# EAGLE schematic DorothiController (EAGLE 9.2.2)

## Sheet 1 of 3
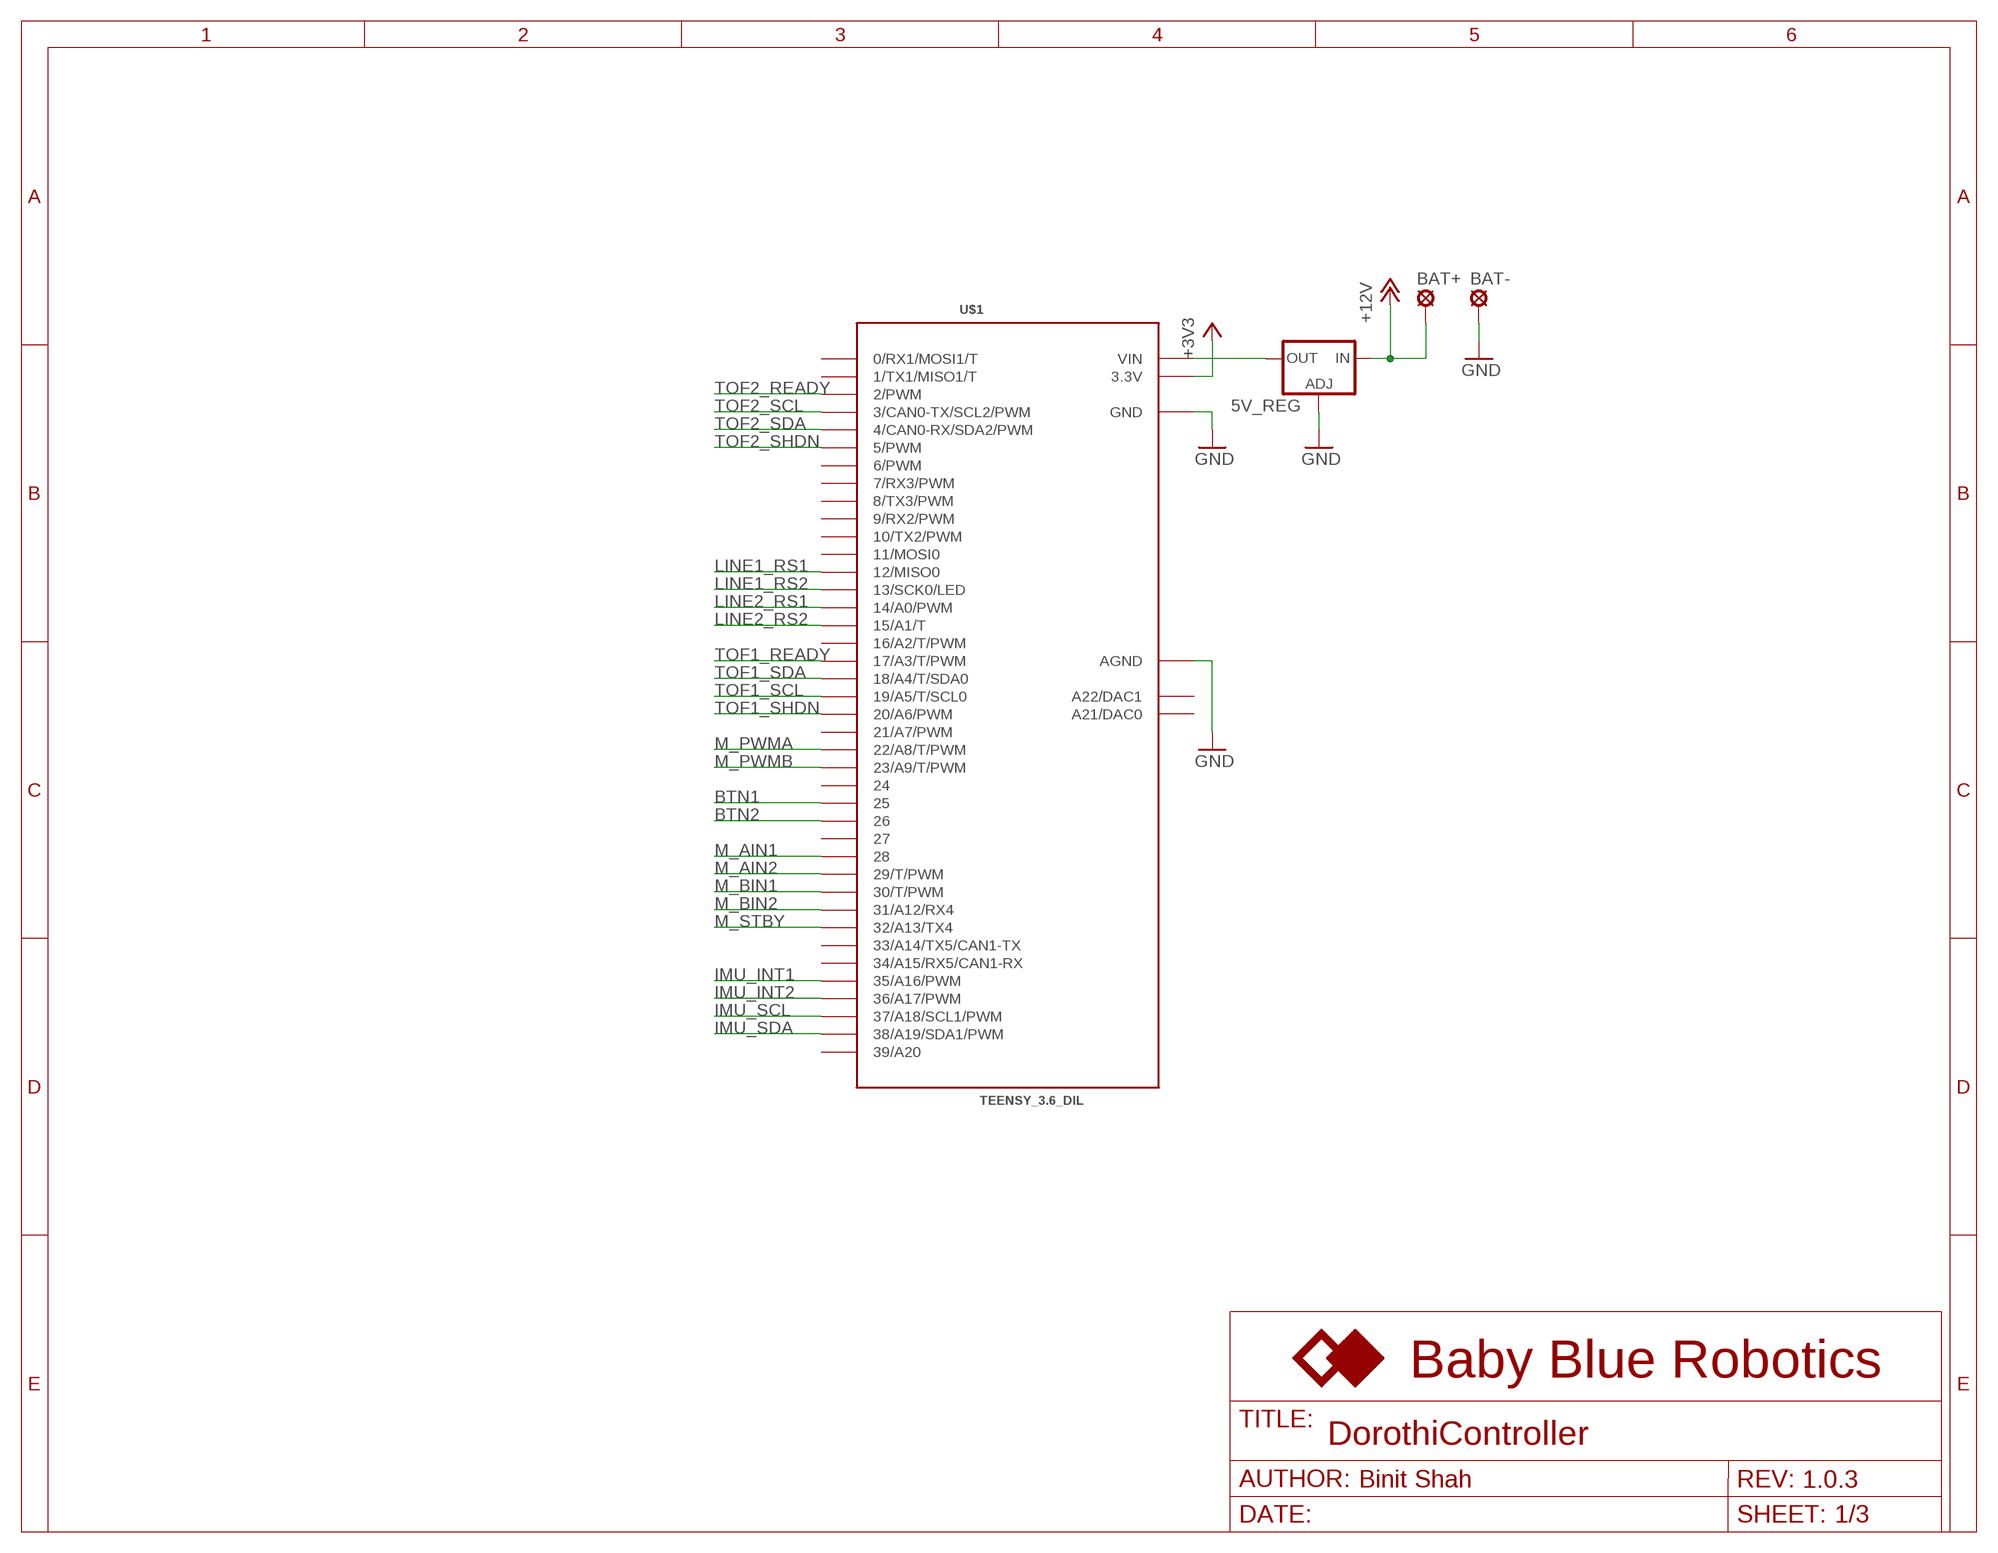
[diagram p0: schematic, sheet 1]
FRAME1 (FRAME_A_L): AUTHOR_NAME: Binit Shah; REV: 1.0.3

### Parts
5V_REG  LM138-TL  [TO220L1]
BAT+  24_SOLPAD  [WIRE_SOLPAD]
BAT-  24_SOLPAD  [WIRE_SOLPAD]
U$1  TEENSY_3.6_DIL  [TEENSY_3.6_DIL]

### Nets
+3V3: U$1.3.3V U$1.3.3V3(3.3V) ; also sheet 2,3
+12V: 5V_REG.3(IN) BAT+.P$1(MP) ; also sheet 2
BTN1: U$1.25 ; also sheet 3
BTN2: U$1.26 ; also sheet 3
GND: 5V_REG.1(ADJ) BAT-.P$1(MP) U$1.AGND U$1.GND U$1.GND1(GND) ; also sheet 2,3
IMU_INT1: U$1.35/A16(35/A16/PWM) ; also sheet 3
IMU_INT2: U$1.36/A17(36/A17/PWM) ; also sheet 3
IMU_SCL: U$1.37/A18(37/A18/SCL1/PWM) ; also sheet 3
IMU_SDA: U$1.38/A19(38/A19/SDA1/PWM) ; also sheet 3
LINE1_RS1: U$1.12(12/MISO0) ; also sheet 3
LINE1_RS2: U$1.13(13/SCK0/LED) ; also sheet 3
LINE2_RS1: U$1.14/A0(14/A0/PWM) ; also sheet 3
LINE2_RS2: U$1.15/A1(15/A1/T) ; also sheet 3
M_AIN1: U$1.28 ; also sheet 2
M_AIN2: U$1.29(29/T/PWM) ; also sheet 2
M_BIN1: U$1.30(30/T/PWM) ; also sheet 2
M_BIN2: U$1.31/A12(31/A12/RX4) ; also sheet 2
M_PWMA: U$1.22/A8(22/A8/T/PWM) ; also sheet 2
M_PWMB: U$1.23/A9(23/A9/T/PWM) ; also sheet 2
M_STBY: U$1.32/A13(32/A13/TX4) ; also sheet 2
N$6: 5V_REG.2(OUT) U$1.VIN
TOF1_READY: U$1.17/A3(17/A3/T/PWM) ; also sheet 3
TOF1_SCL: U$1.19/A5(19/A5/T/SCL0) ; also sheet 3
TOF1_SDA: U$1.18/A4(18/A4/T/SDA0) ; also sheet 3
TOF1_SHDN: U$1.20/A6(20/A6/PWM) ; also sheet 3
TOF2_READY: U$1.2(2/PWM) ; also sheet 3
TOF2_SCL: U$1.3(3/CAN0-TX/SCL2/PWM) ; also sheet 3
TOF2_SDA: U$1.4(4/CAN0-RX/SDA2/PWM) ; also sheet 3
TOF2_SHDN: U$1.5(5/PWM) ; also sheet 3
Unconnected: U$1.0(0/RX1/MOSI1/T) U$1.1(1/TX1/MISO1/T) U$1.6(6/PWM) U$1.7(7/RX3/PWM) U$1.8(8/TX3/PWM) U$1.9(9/RX2/PWM) U$1.10(10/TX2/PWM) U$1.11(11/MOSI0) U$1.16/A2(16/A2/T/PWM) U$1.21/A7(21/A7/PWM) U$1.24 U$1.27 U$1.33/A14(33/A14/TX5/CAN1-TX) U$1.34/A15(34/A15/RX5/CAN1-RX) U$1.39/A20 U$1.A21(A21/DAC0) U$1.A22(A22/DAC1)

## Sheet 2 of 3
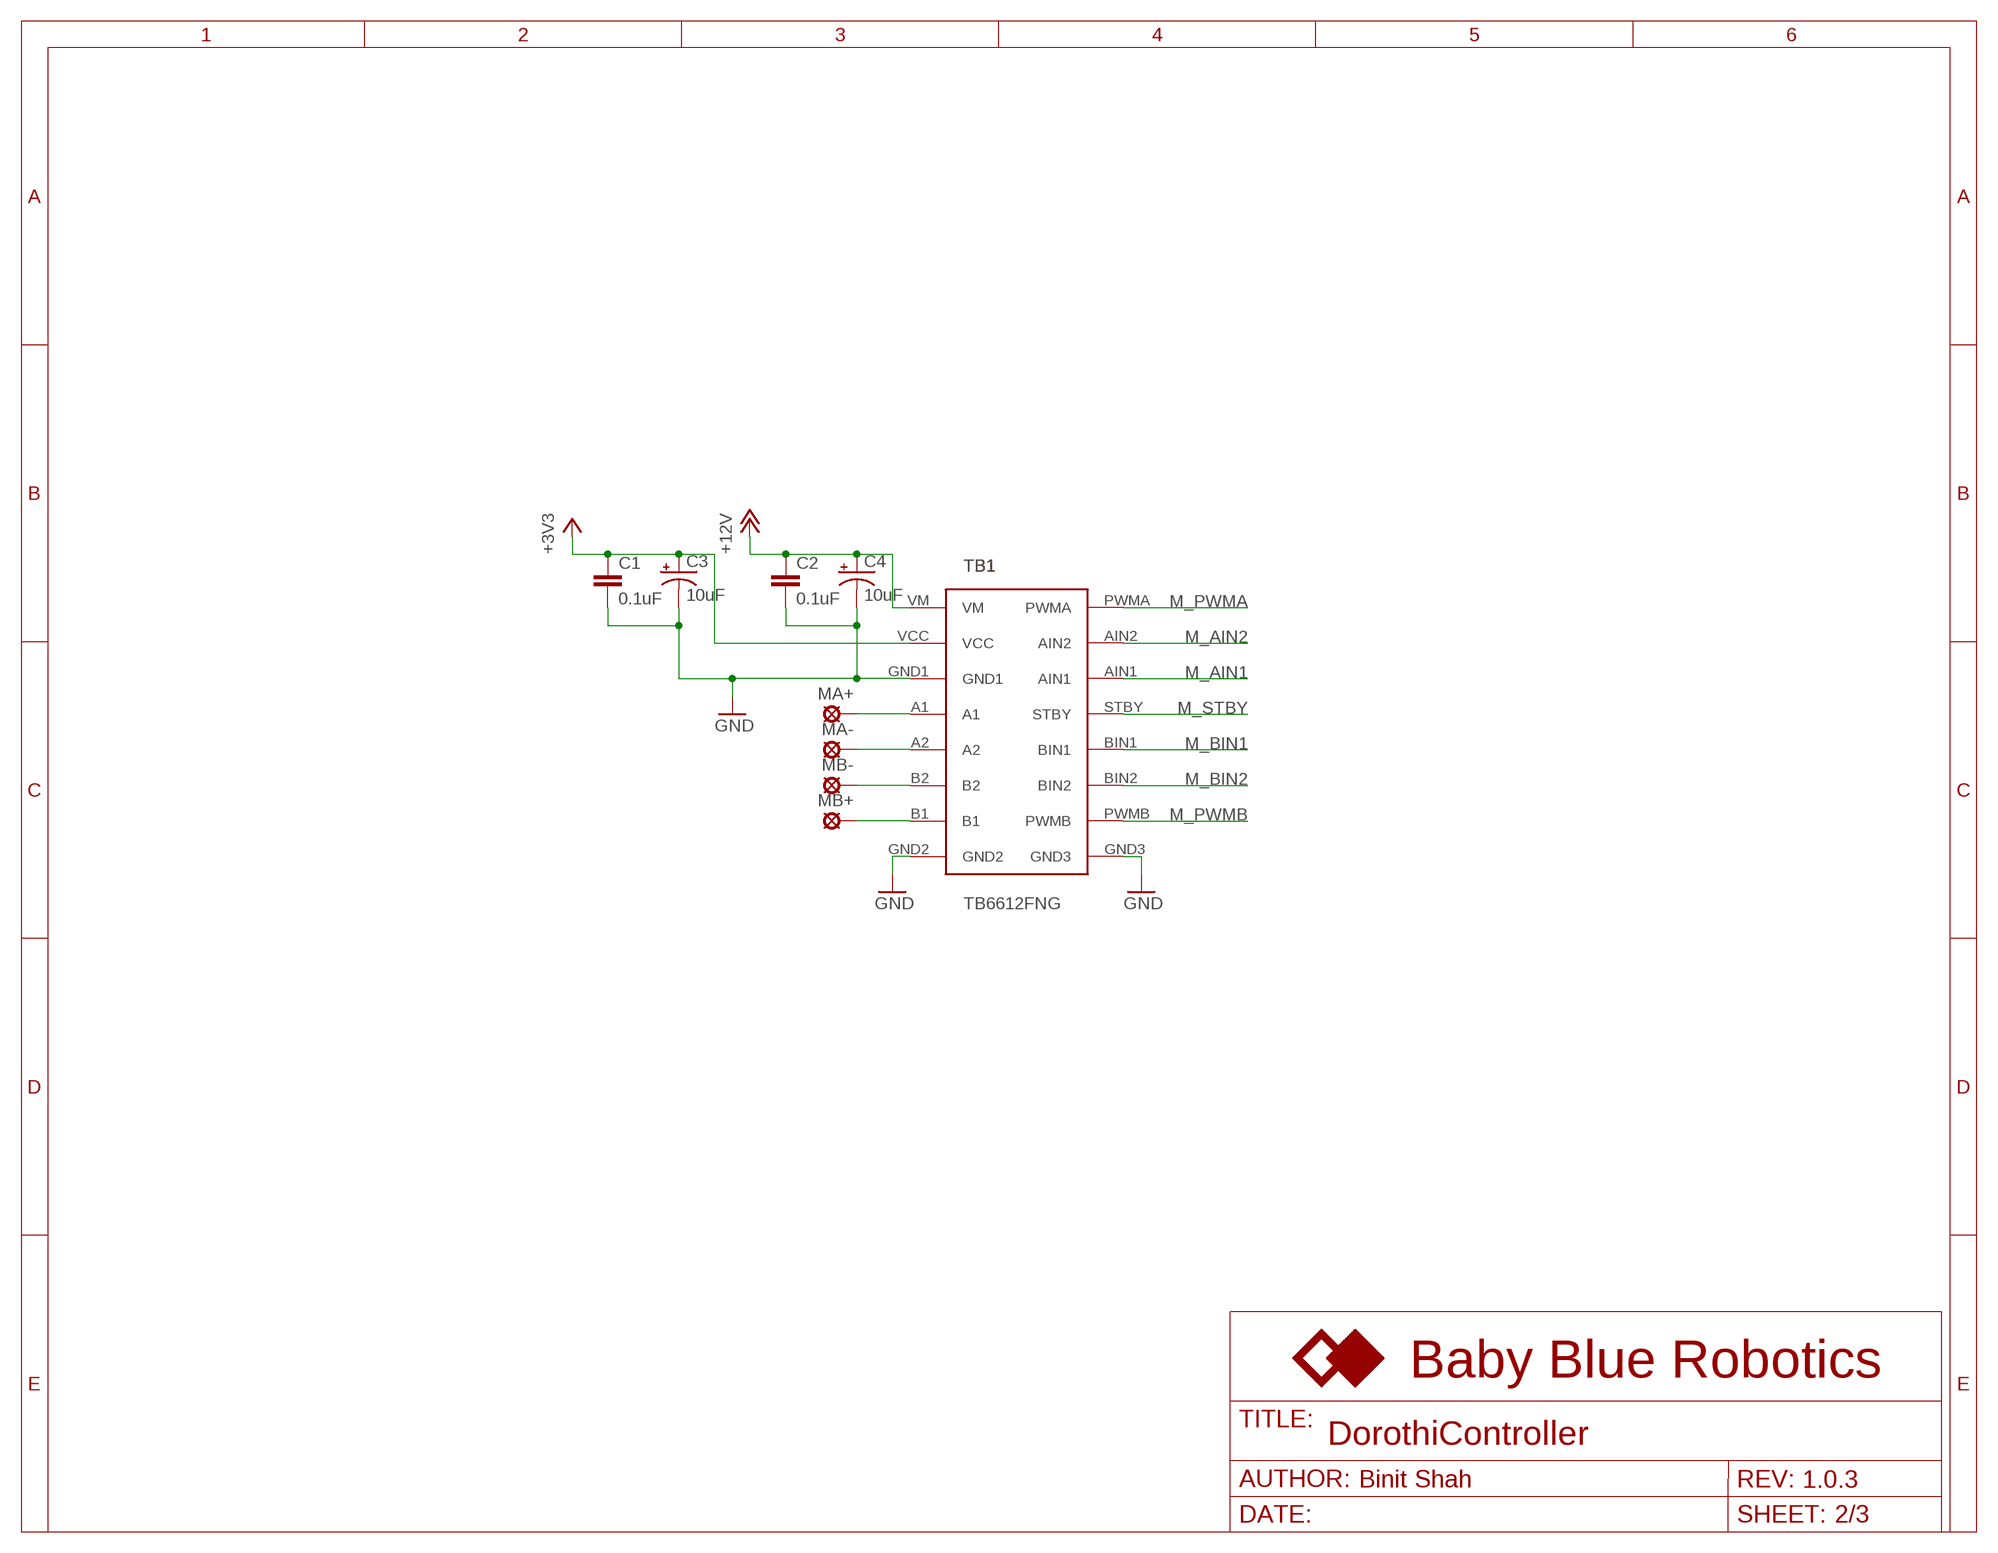
[diagram p1: schematic, sheet 2]
FRAME2 (FRAME_A_L): AUTHOR_NAME: Binit Shah; REV: 1.0.3

### Parts
C1  0.1uF  0.1UF-0603-25V-5%  [0603]
C2  0.1uF  0.1UF-0603-25V-5%  [0603]
C3  10uF  10UF-POLAR-EIA3528-20V-10%(TANT)  [EIA3528]
C4  10uF  10UF-POLAR-EIA3528-20V-10%(TANT)  [EIA3528]
MA+  24_SOLPAD  [WIRE_SOLPAD]
MA-  24_SOLPAD  [WIRE_SOLPAD]
MB+  24_SOLPAD  [WIRE_SOLPAD]
MB-  24_SOLPAD  [WIRE_SOLPAD]
TB1  TB6612FNG  [TB6612FNG]

### Nets
+3V3: C1.1 C3.A(+) TB1.VCC ; also sheet 1,3
+12V: C2.1 C4.A(+) TB1.VM ; also sheet 1
GND: C1.2 C2.2 C3.C(-) C4.C(-) TB1.GND1 TB1.GND2 TB1.GND3 ; also sheet 1,3
M_AIN1: TB1.AIN1 ; also sheet 1
M_AIN2: TB1.AIN2 ; also sheet 1
M_BIN1: TB1.BIN1 ; also sheet 1
M_BIN2: TB1.BIN2 ; also sheet 1
M_PWMA: TB1.PWMA ; also sheet 1
M_PWMB: TB1.PWMB ; also sheet 1
M_STBY: TB1.STBY ; also sheet 1
MA+: MA+.P$1(MP) TB1.A1
MA-: MA-.P$1(MP) TB1.A2
MB+: MB+.P$1(MP) TB1.B1
MB-: MB-.P$1(MP) TB1.B2

## Sheet 3 of 3
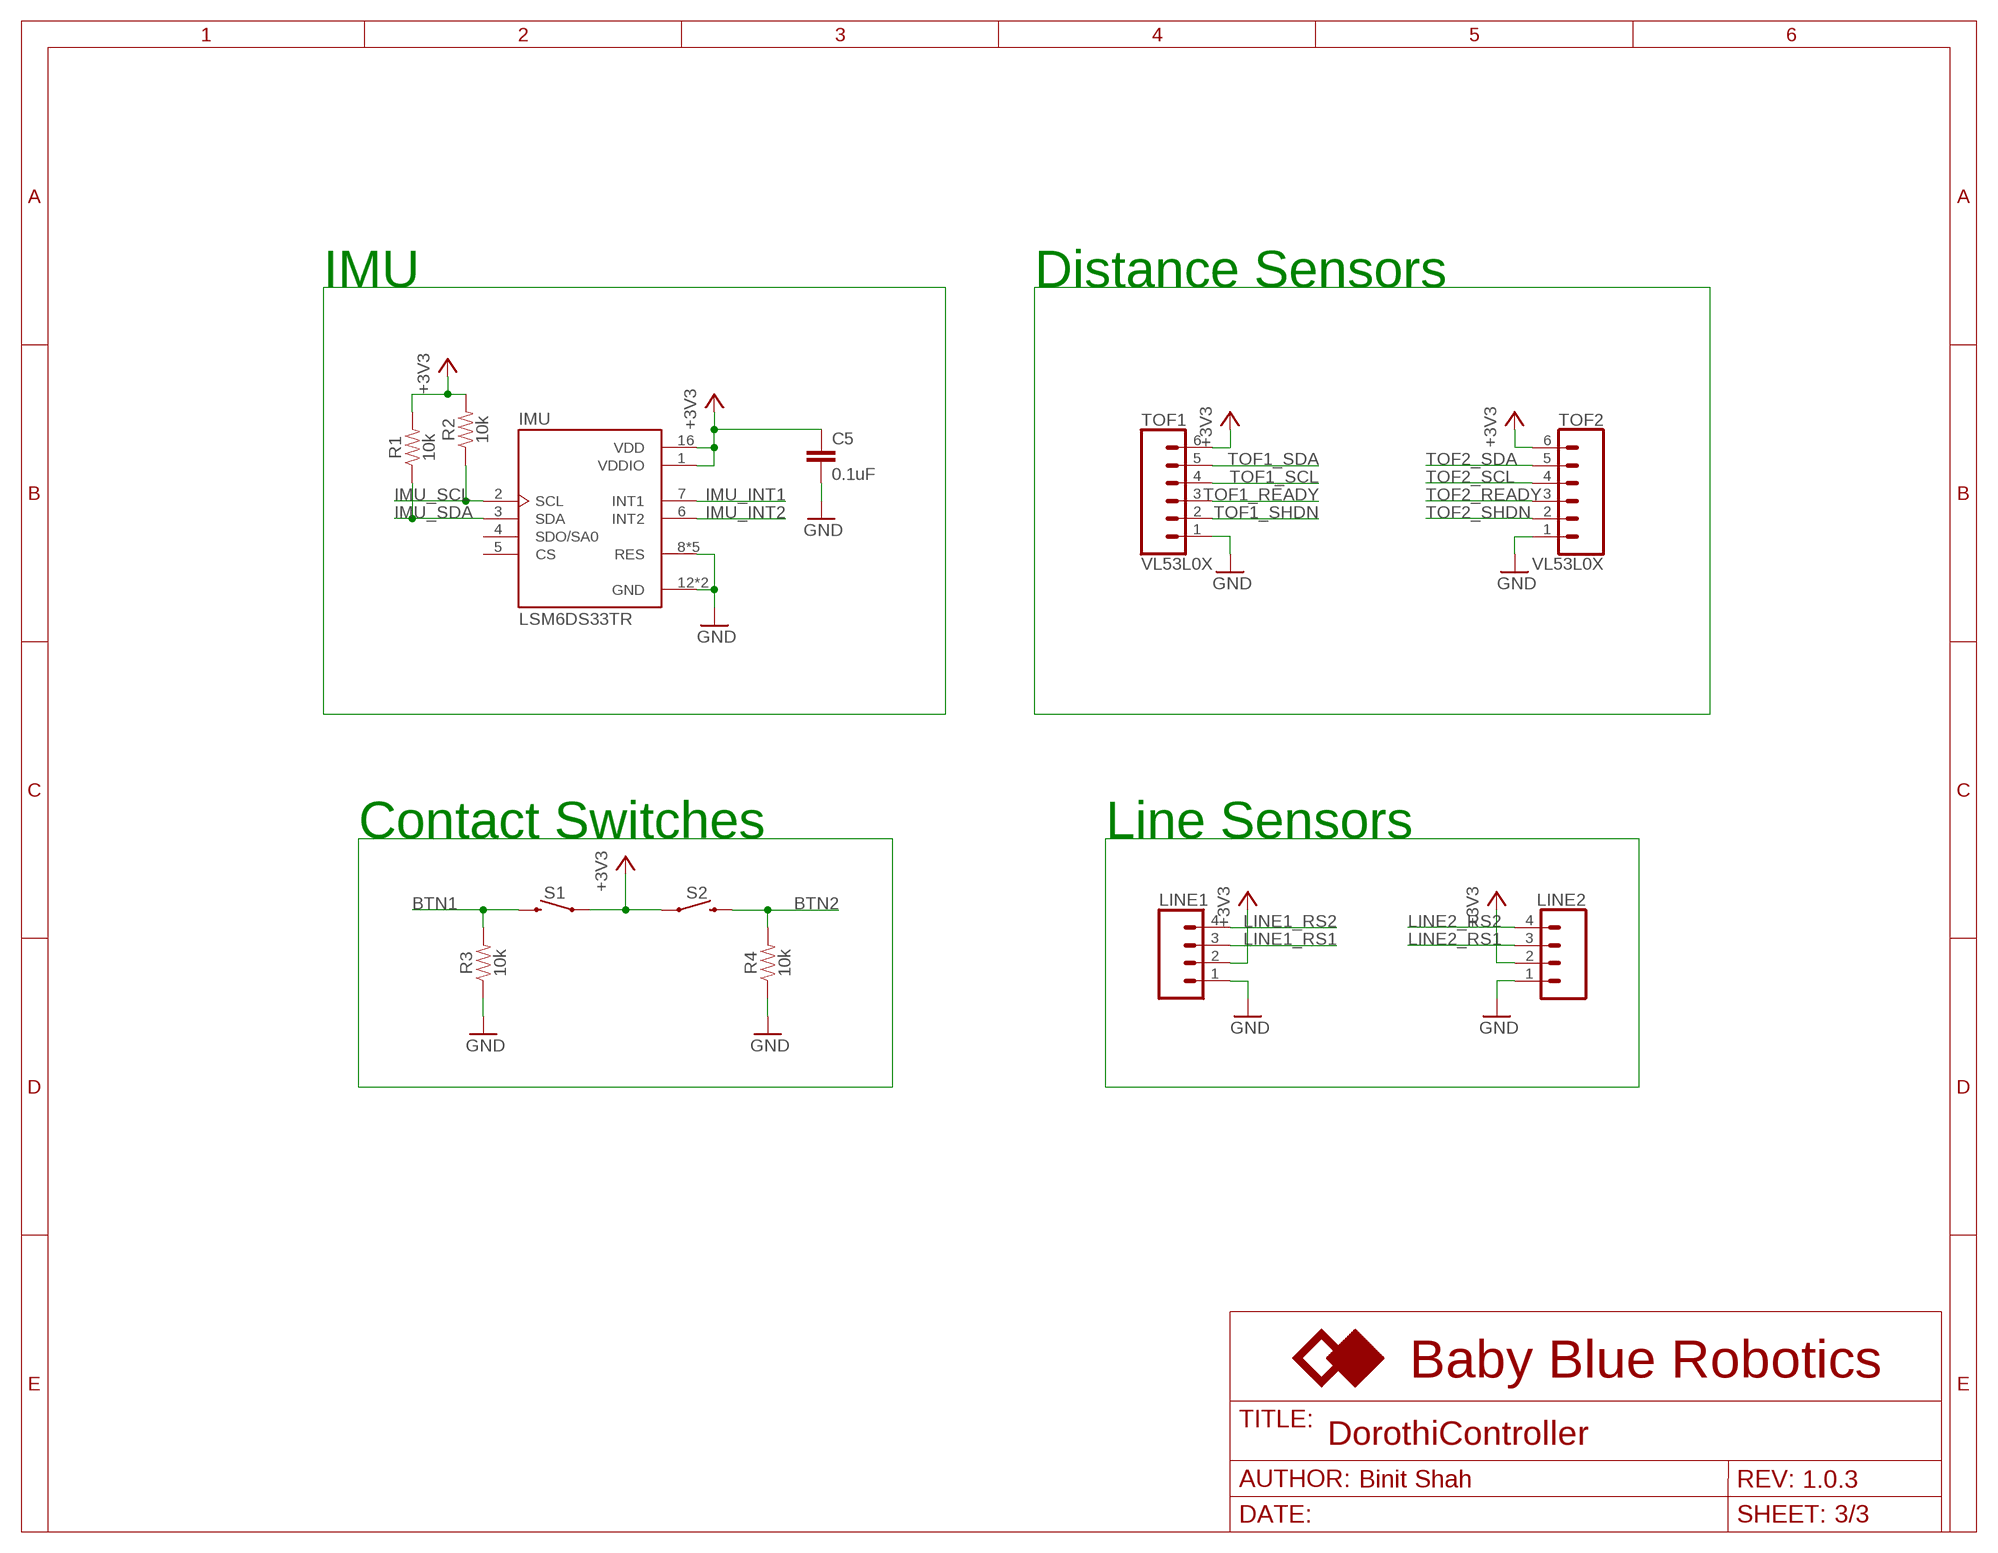
[diagram p2: schematic, sheet 3]
FRAME3 (FRAME_A_L): AUTHOR_NAME: Binit Shah; REV: 1.0.3

### Parts
C5  0.1uF  0.1UF-0603-25V-5%  [0603]
IMU  LSM6DS33TR  [PQFN50P300X300X86-16N]
LINE1  CONN_04  [1X04]
LINE2  CONN_04  [1X04]
R1  10k  10KOHM-0603-1/10W-1%  [0603]
R2  10k  10KOHM-0603-1/10W-1%  [0603]
R3  10k  10KOHM-0603-1/10W-1%  [0603]
R4  10k  10KOHM-0603-1/10W-1%  [0603]
S1  MOMENTARY-SWITCH-SPST-PTH-12MM  [TACTILE_SWITCH_PTH_12MM]
S2  MOMENTARY-SWITCH-SPST-PTH-12MM  [TACTILE_SWITCH_PTH_12MM]
TOF1  VL53L0X  CONN_06SILK_FEMALE_PTH  [1X06]
TOF2  VL53L0X  CONN_06SILK_FEMALE_PTH  [1X06]

### Nets
+3V3: C5.1 IMU.1(VDDIO) IMU.16(VDD) LINE1.2 LINE2.2 R1.2 R2.2 S1.1 S2.1 TOF1.6 TOF2.6 ; also sheet 1,2
BTN1: R3.2 S1.3 ; also sheet 1
BTN2: R4.2 S2.3 ; also sheet 1
GND: C5.2 IMU.8(RES) IMU.9(RES) IMU.10(RES) IMU.11(RES) IMU.12(GND) IMU.13(GND) IMU.15(RES) LINE1.1 LINE2.1 R3.1 R4.1 TOF1.1 TOF2.1 ; also sheet 1,2
IMU_INT1: IMU.7(INT1) ; also sheet 1
IMU_INT2: IMU.6(INT2) ; also sheet 1
IMU_SCL: IMU.2(SCL) R2.1 ; also sheet 1
IMU_SDA: IMU.3(SDA) R1.1 ; also sheet 1
LINE1_RS1: LINE1.3 ; also sheet 1
LINE1_RS2: LINE1.4 ; also sheet 1
LINE2_RS1: LINE2.3 ; also sheet 1
LINE2_RS2: LINE2.4 ; also sheet 1
TOF1_READY: TOF1.3 ; also sheet 1
TOF1_SCL: TOF1.4 ; also sheet 1
TOF1_SDA: TOF1.5 ; also sheet 1
TOF1_SHDN: TOF1.2 ; also sheet 1
TOF2_READY: TOF2.3 ; also sheet 1
TOF2_SCL: TOF2.4 ; also sheet 1
TOF2_SDA: TOF2.5 ; also sheet 1
TOF2_SHDN: TOF2.2 ; also sheet 1
Unconnected: IMU.4(SDO/SA0) IMU.5(CS)

### Notes on the sheet
- IMU | Distance Sensors
- Contact Switches | Line Sensors

## Library data of the parts
5V_REG = v-reg:LM138-TL: VOLTAGE REGULATOR
BAT+ BAT- MA+ MA- MB+ MB- = nickZhang:2*4_SOLPAD: SOLDER PAD RTM, drill 1,1mm, distributor Buerklin, 07F810
C1 C2 C5 = SparkFun-Capacitors:0.1UF: 0.1µF ceramic capacitors A capacitor is a passive two-terminal electrical component used to store electrical energy temporarily in an electric field.; PROD_ID: CAP-08604
C3 C4 = SparkFun-Capacitors:10UF-POLAR: 10.0µF polarized capacitors A capacitor is a passive two-terminal electrical component used to store electrical energy temporarily in an electric field.; PROD_ID: CAP-08063
IMU = LSM6DS33TR:LSM6DS33TR: Integrated Circuit, Misc s 3d Accelerometer And Gyro Lsm6ds3; AVAILABILITY: Unavailable; DESCRIPTION: Integrated Circuit, Misc s 3d Accelerometer And Gyro Lsm6ds3; MF: STMicroelectronics; MP: LSM6DS33TR; PACKAGE: LGA-16 STMicroelectronics; PRICE: None
LINE1 LINE2 = SparkFun-Connectors:CONN_04: Multi connection point. Often used as Generic Header-pin footprint for 0.1 inch spaced/style header connections On any of the 0.1 inch spaced packages, you can populate with these: Break Away Headers - Straight <https://www.sparkfun.com/products/116> (PRT-00116) Break Away Male Headers - Right Angle <https://www.sparkfun.com/products/553> (PRT-00553) Female Headers <https://www.sparkfun.com/products/115> (PRT-00115) Break Away Headers - Machine Pin <https://www.sparkfun.com/products/117> (PRT-00117) Break Away Female Headers - Swiss Machine Pin <https://www.sparkfun.com/products/743> (PRT-00743) For SCREWTERMINALS and SPRING TERMINALS visit here: Screw Terimnals on SparkFun.com <https://www.sparkfun.com/search/results?term=Screw+Terminals> (5mm/3.5mm/2.54mm spacing) This device is also useful as a general connection point to wire up your design to another part of your project. Our various solder wires solder well into these plated through hole pads. Hook-Up Wire - Assortment (Stranded, 22 AWG) <https://www.sparkfun.com/products/11375> (PRT-11375) Hook-Up Wire - Assortment (Solid Core, 22 AWG) <https://www.sparkfun.com/products/11367> (PRT-11367) View the entire wire category on our website here <https://www.sparkfun.com/categories/141> Special notes: Molex polarized connector foot print use with SKU : PRT-08231 with associated crimp pins and housings. 1MM SMD Version SKU: PRT-10208; PROD_ID: CONN-09696
R1-R4 = SparkFun-Resistors:10KOHM: 10kΩ resistor A resistor is a passive two-terminal electrical component that implements electrical resistance as a circuit element. Resistors act to reduce current flow, and, at the same time, act to lower voltage levels within circuits. - Wikipedia; PROD_ID: RES-00824
S1 S2 = SparkFun-Switches:MOMENTARY-SWITCH-SPST: Momentary Switch (Pushbutton) - SPST Normally-open (NO) SPST momentary switches (buttons, pushbuttons). Variants PTH-12MM - 12mm square, through-hole Momentary Pushbutton Switch - 12mm Square <https://www.sparkfun.com/products/9190> (COM-09190) PTH-6.0MM, PTH-6.0MM-KIT - 6.0mm square, through-hole Mini Pushbutton Switch <https://www.sparkfun.com/products/97> (COM-00097) KIT package intended for soldering kit's - only one side of pads' copper is exposed. PTH-RIGHT-ANGLE-KIT - Right-angle, through-hole Right Angle Tactile Button <https://www.sparkfun.com/products/10791> - Used on SparkFun BigTime Watch Kit <https://www.sparkfun.com/products/11734> SMD-12MM - 12mm square, surface-mount Tactile Button - SMD (12mm) <https://www.sparkfun.com/products/12993> (COM-12993) Used on SparkFun PicoBoard <https://www.sparkfun.com/products/11888> SMD-4.5MM - 4.5mm Square Trackball Switch Used on SparkFun Blackberry Trackballer Breakout <https://www.sparkfun.com/products/13169> SMD-4.6MMX2.8MM - 4.60mm x 2.80mm, surface mount Used on SparkFun SAMD21 Mini Breakout <https://www.sparkfun.com/products/13664> SMD-5.2MM, SMD-5.2-REDUNDANT - 5.2mm square, surface-mount Mini Pushbutton Switch - SMD <https://www.sparkfun.com/products/8720> (COM-08720) Used on Arduino Pro Mini <https://www.sparkfun.com/products/11114> REDUNDANT package connects both switch circuits together SMD-6.0X3.5MM - 6.0 x 3.5mm, surface mount Momentary Reset Switch SMD <https://www.sparkfun.com/products/8229> (COM-08229) SMD-6.2MM-TALL - 6.2mm square, surface mount Tactile Button - SMD (6mm) <https://www.sparkfun.com/products/12992> Used on SparkFun Digital Sandbox <https://www.sparkfun.com/products/12651> SMD-RIGHT-ANGLE - Right-angle, surface mount Used on SparkFun Block for Intel® Edison - Arduino <https://www.sparkfun.com/products/13036>; PROD_ID: SWCH-09185; SF_SKU: COM-09190
TB1 = TB6612FNG:TB6612FNG
TOF1 TOF2 = SparkFun-Connectors:CONN_06: Multi connection point. Often used as Generic Header-pin footprint for 0.1 inch spaced/style header connections On any of the 0.1 inch spaced packages, you can populate with these: Break Away Headers - Straight <https://www.sparkfun.com/products/116> (PRT-00116) Break Away Male Headers - Right Angle <https://www.sparkfun.com/products/553> (PRT-00553) Female Headers <https://www.sparkfun.com/products/115> (PRT-00115) Break Away Headers - Machine Pin <https://www.sparkfun.com/products/117> (PRT-00117) Break Away Female Headers - Swiss Machine Pin <https://www.sparkfun.com/products/743> (PRT-00743) Arduino Stackable Header - 6 Pin <https://www.sparkfun.com/products/9280> (PRT-09280) For SCREWTERMINALS and SPRING TERMINALS visit here: Screw Terimnals on SparkFun.com <https://www.sparkfun.com/search/results?term=Screw+Terminals> (5mm/3.5mm/2.54mm spacing) This device is also useful as a general connection point to wire up your design to another part of your project. Our various solder wires solder well into these plated through hole pads. Hook-Up Wire - Assortment (Stranded, 22 AWG) <https://www.sparkfun.com/products/11375> (PRT-11375) Hook-Up Wire - Assortment (Solid Core, 22 AWG) <https://www.sparkfun.com/products/11367> (PRT-11367) View the entire wire category on our website here <https://www.sparkfun.com/categories/141>; PROD_ID: CONN-08437
U$1 = Teensy_3_and_LC_Series_Boards_v1.4:TEENSY_3.6_DIL: Teensy 3.6 DIL Package